# Altium schematic sheet gecko3main-tester.SchDoc: GECKO3main Productiontester
size A4; Author: zac1; DrawnBy: zac1; Organization: Berne University of Applied Science; Address1: School of Engineering and; Address2: Information Technology; Address3: Quellgasse 21; Address4: CH-2501 Biel; Revision: 1; SheetNumber: 1; SheetTotal: 6
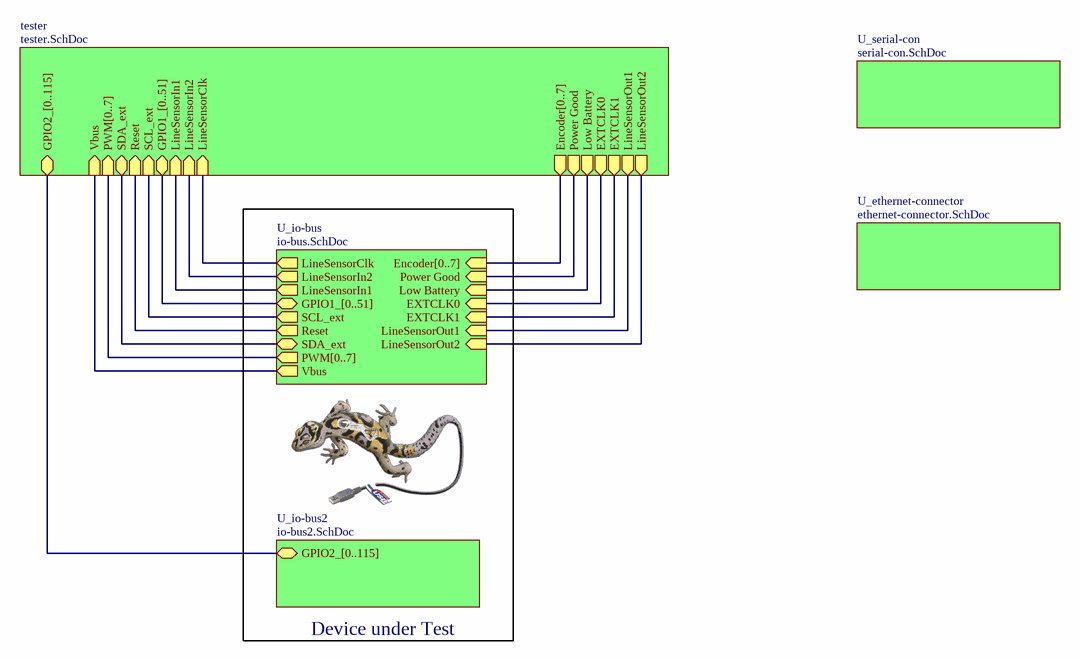
[diagram p0: gecko3main-tester.SchDoc]

## Parts
1  CC License  [CC-License]  (value not drawn)
2  (no value)  [GECKO3]

## Blocks framed on the sheet
Device under Test: 2

## Sub-sheets
tester = tester.SchDoc: GPIO2_[0..115] (bidir), Vbus (in), PWM[0..7] (in), Encoder[0..7] (out), Power Good (out), Low Battery (out), SDA_ext (bidir), Reset (in), SCL_ext (in), EXTCLK0 (out), EXTCLK1 (out), GPIO1_[0..51] (bidir), LineSensorIn1 (in), LineSensorIn2 (in), LineSensorOut1 (out), LineSensorOut2 (out), LineSensorClk (in)
U_ethernet-connector = ethernet-connector.SchDoc: no entries
U_io-bus = io-bus.SchDoc: Vbus (out), PWM[0..7] (out), Encoder[0..7] (in), Power Good (in), Low Battery (in), SDA_ext (bidir), Reset (out), SCL_ext (out), EXTCLK0 (in), EXTCLK1 (in), GPIO1_[0..51] (bidir), LineSensorIn1 (out), LineSensorIn2 (out), LineSensorOut1 (in), LineSensorOut2 (in), LineSensorClk (out)
U_io-bus2 = io-bus2.SchDoc: GPIO2_[0..115] (bidir)
U_serial-con = serial-con.SchDoc: no entries

## Nets
(unnamed): sheet U_io-bus/Vbus, sheet tester/Vbus
(unnamed): sheet U_io-bus/Power Good, sheet tester/Power Good
(unnamed): sheet U_io-bus/Low Battery, sheet tester/Low Battery
(unnamed): sheet U_io-bus/SDA_ext, sheet tester/SDA_ext
(unnamed): sheet U_io-bus/Reset, sheet tester/Reset
(unnamed): sheet U_io-bus/SCL_ext, sheet tester/SCL_ext
(unnamed): sheet U_io-bus/EXTCLK0, sheet tester/EXTCLK0
(unnamed): sheet U_io-bus/EXTCLK1, sheet tester/EXTCLK1
(unnamed): sheet U_io-bus/LineSensorIn1, sheet tester/LineSensorIn1
(unnamed): sheet U_io-bus/LineSensorIn2, sheet tester/LineSensorIn2
(unnamed): sheet U_io-bus/LineSensorOut1, sheet tester/LineSensorOut1
(unnamed): sheet U_io-bus/LineSensorOut2, sheet tester/LineSensorOut2
(unnamed): sheet U_io-bus/LineSensorClk, sheet tester/LineSensorClk

## Buses and harness runs
bus sheet tester/Encoder[0..7] = sheet U_io-bus/Encoder[0..7]
bus sheet tester/GPIO1_[0..51] = sheet U_io-bus/GPIO1_[0..51]
bus sheet tester/GPIO2_[0..115] = sheet U_io-bus2/GPIO2_[0..115]
bus sheet tester/PWM[0..7] = sheet U_io-bus/PWM[0..7]

## Notes on the sheet
- Title:
- Size:
- Date:
- A4_L
- Author:
- Time:
- Revision:
- Sheet
- of
- File:

## Library data of the parts
2 = Gecko3